# EasyEDA schematic SCH_esp32+sensors_2026-04-30.json
TITLE: Sheet_1; REV: 1.0; Date: 2026-04-30; Sheet: 1/1; Drawn By: kristina112; Company: Your Company
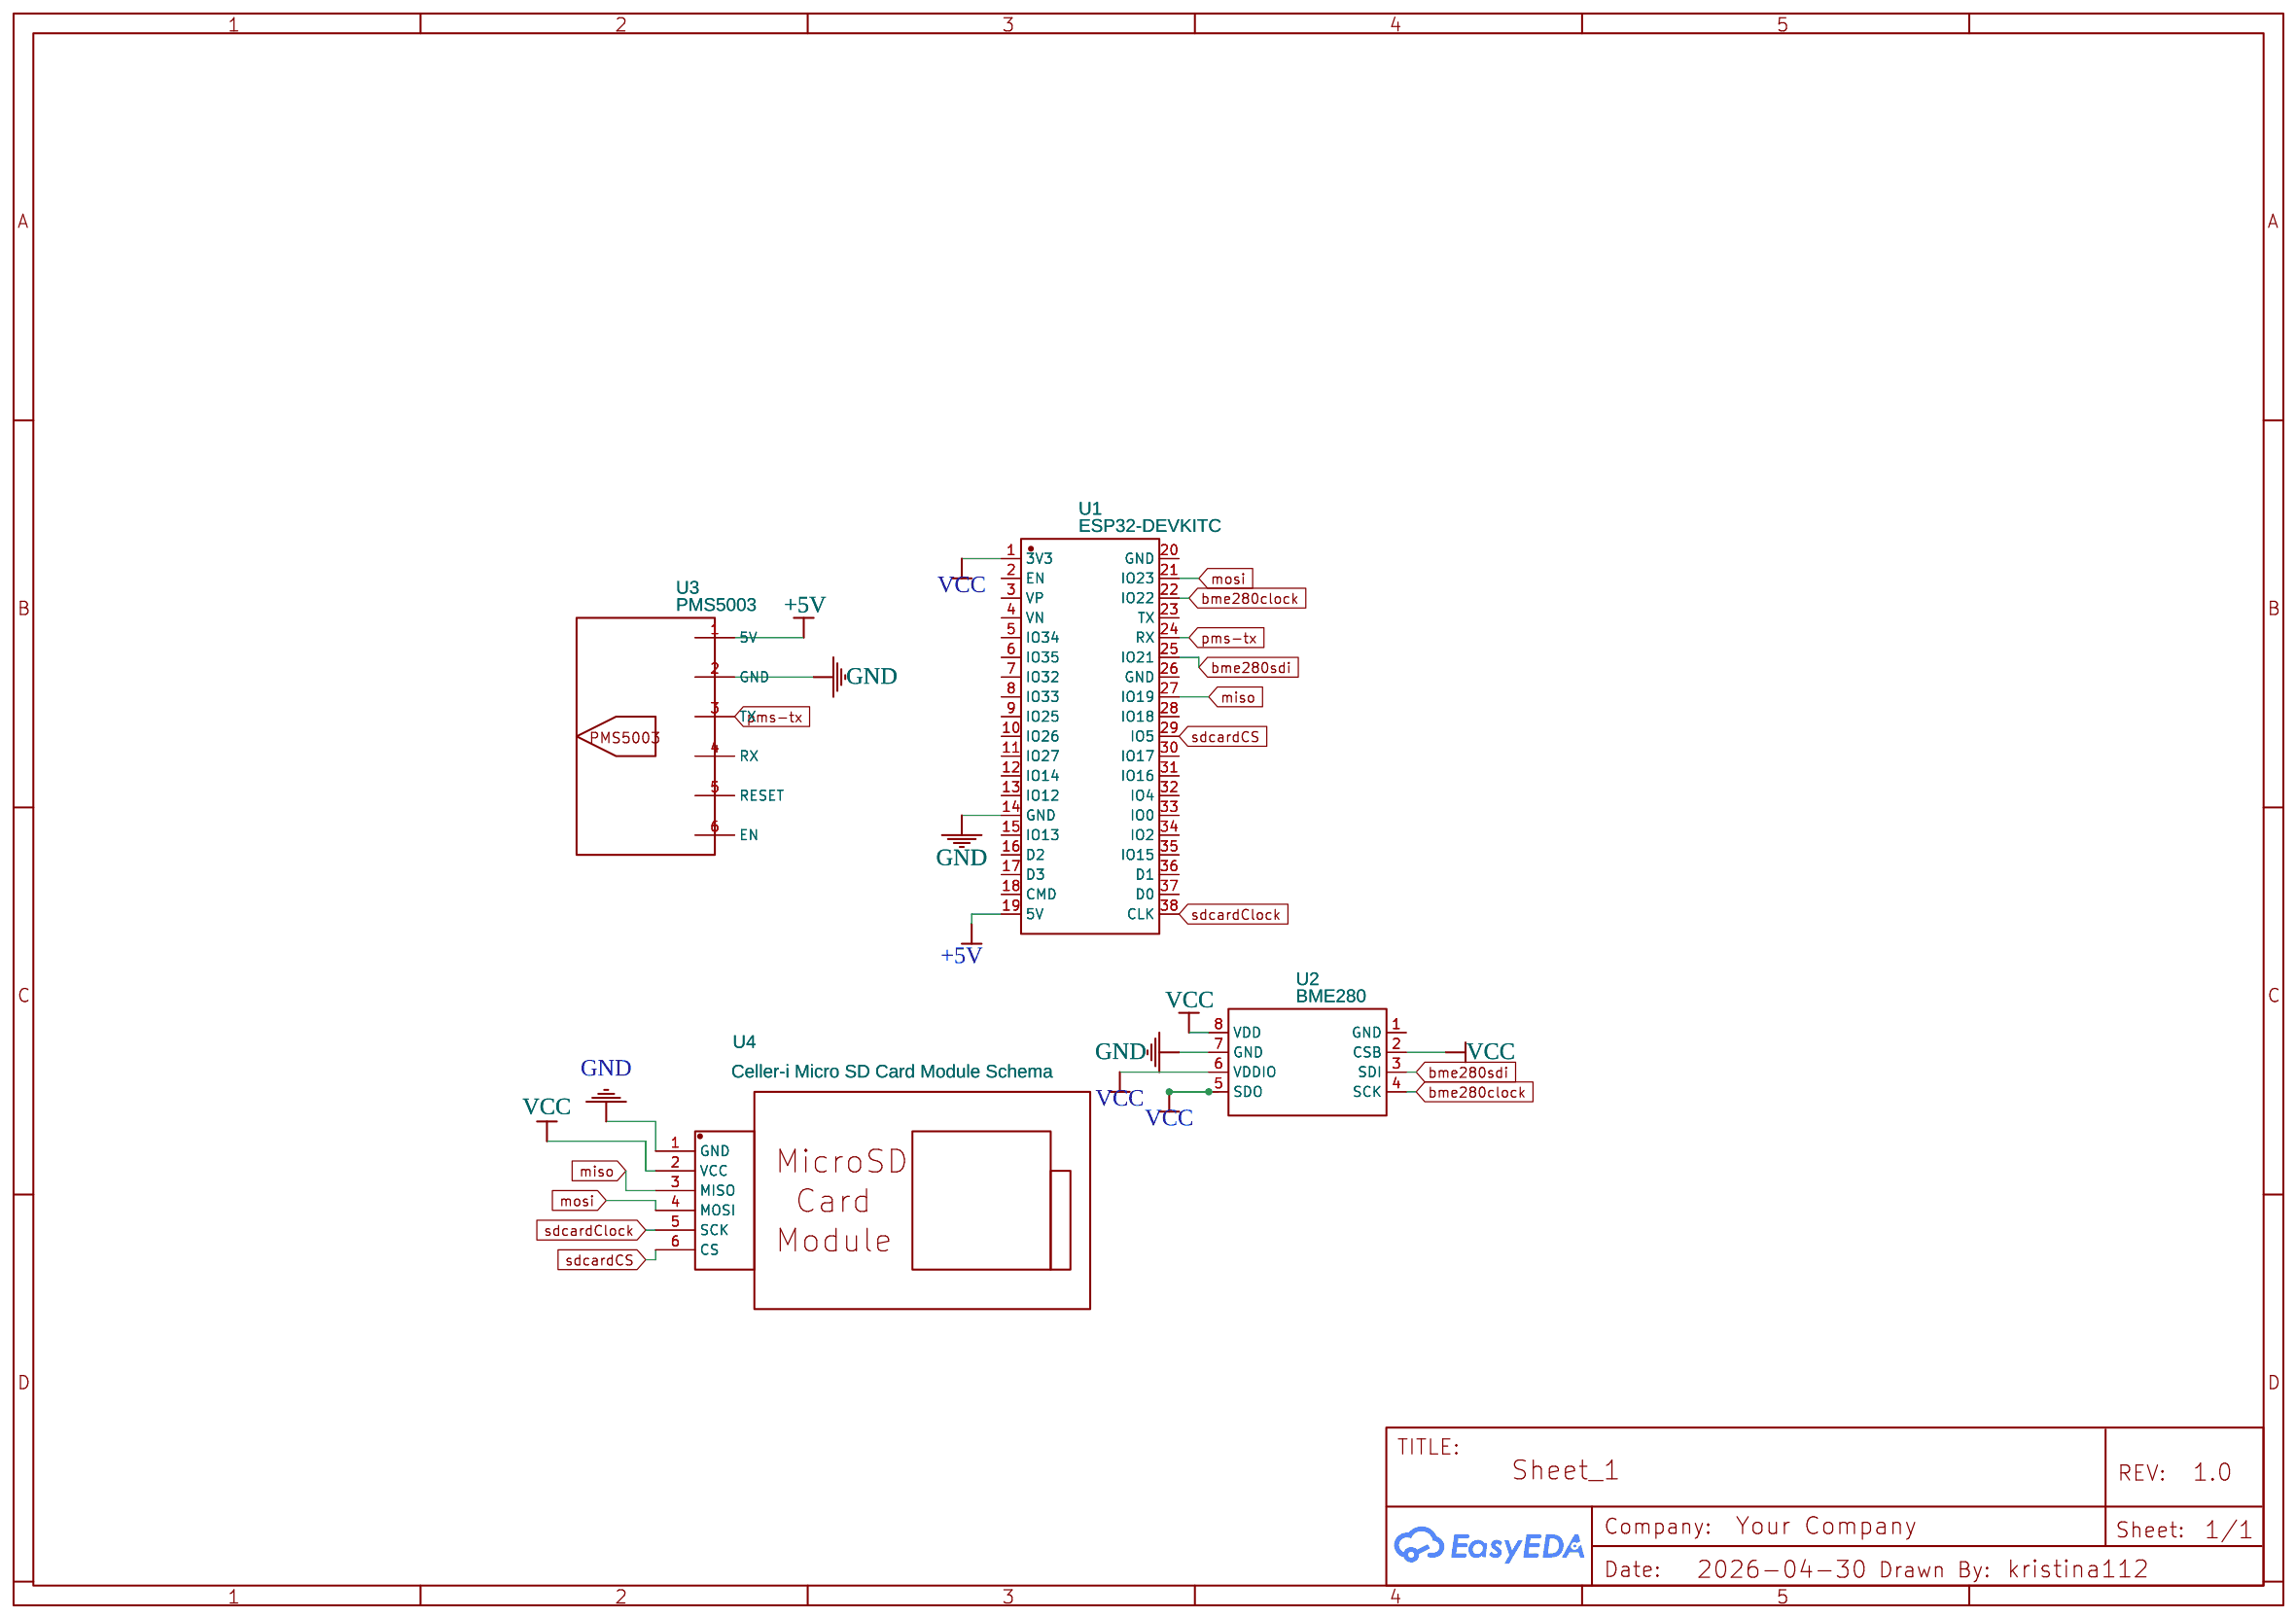
[diagram p0: schematic sheet]

## Parts
U1  ESP32-DEVKITC  [BULETM-SMD_ESP32-DEVKITC]
U2  BME280  [LGA-8_BME280_BL]
U3  PMS5003  [PMS5003]
U4  Celler-i Micro SD Card Module Schema  [CELLER-I FOTPRINT FOR MICRO SD CARD MODULE PCB PACKAGE]

## Library data of the parts
U1 = ESP32-DEVKITC: Supplier: LCSC; Supplier Part: C571180; Manufacturer: ESPRESSIF(乐鑫); Manufacturer Part: ESP32-DevKitC; Contributor: lcsc
U2 = BME280: Contributor: LCSC; Supplier: LCSC; Manufacturer: Bosch(博世); Supplier Part: C92489; JLCPCB Part Class: Extended Part
U3 = PMS5003: Contributor: romanaspeekbloor
U4 = Celler-i Micro SD Card Module Schema: Contributor: Wensmark

## Nets
+5V: U1.19(5V) U3.1(5V)
GND: U1.14(GND) U2.7(GND) U3.2(GND) U4.1(GND)
VCC: U1.1(3V3) U2.2(CSB) U2.5(SDO) U2.6(VDDIO) U2.8(VDD) U4.2(VCC)
bme280clock: U1.22(IO22) U2.4(SCK)
bme280sdi: U1.25(IO21) U2.3(SDI)
miso: U1.27(IO19) U4.3(MISO)
mosi: U1.21(IO23) U4.4(MOSI)
pms-tx: U1.24(RX)
sdcardClock: U1.38(CLK) U4.5(SCK)
sdcardCS: U1.29(IO5) U4.6(CS)

Not connected (* = marked no-connect by the designer): U1 2(EN) 3(VP) 4(VN) 5(IO34) 6(IO35) 7(IO32) 8(IO33) 9(IO25) 10(IO26) 11(IO27) 12(IO14) 13(IO12) 15(IO13) 16(D2) 17(D3) 18(CMD) 20(GND) 23(TX) 26(GND) 28(IO18) 30(IO17) 31(IO16) 32(IO4) 33(IO0) 34(IO2) 35(IO15) 36(D1) 37(D0); U2 1(GND); U3 3(TX) 4(RX) 5(RESET) 6(EN)
